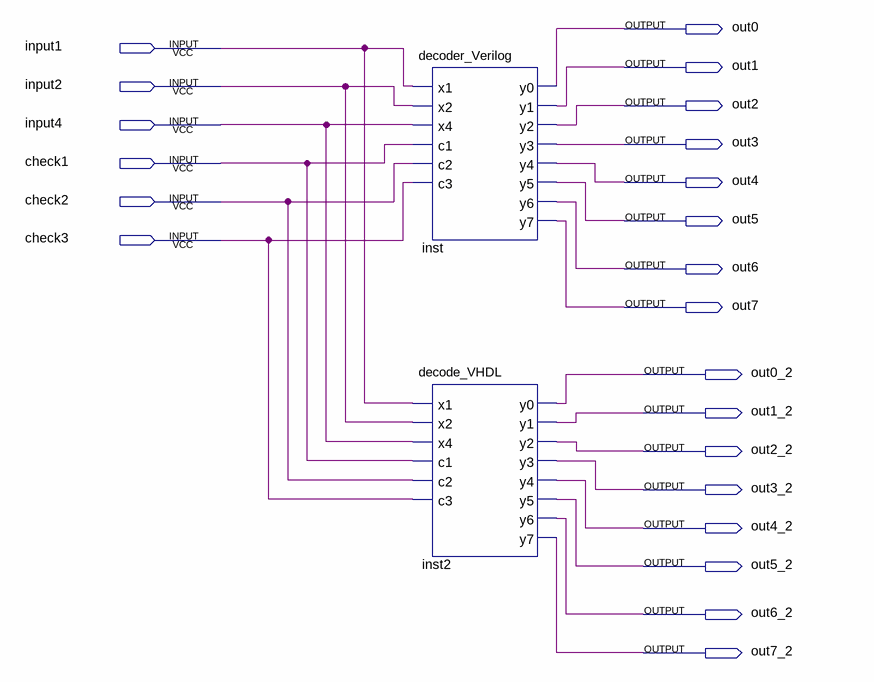
[diagram p0: schematic sheet]
// Quartus schematic Schem1_1.bdf as structural Verilog: 2 symbols, 22 pins
module Schem1_1 (
  input  input1,
  input  input2,
  input  input4,
  input  check1,
  input  check2,
  input  check3,
  output out0,
  output out1,
  output out2,
  output out3,
  output out4,
  output out5,
  output out6,
  output out7,
  output out0_2,
  output out1_2,
  output out2_2,
  output out3_2,
  output out4_2,
  output out5_2,
  output out6_2,
  output out7_2
);

  decoder_Verilog inst (
    .x1(input1), .x2(input2), .x4(input4), .c1(check1), .c2(check2), .c3(check3), .y0(out0), .y1(out1),
    .y2(out2), .y3(out3), .y4(out4), .y5(out5), .y6(out6), .y7(out7));
  decode_VHDL inst2 (
    .x1(input1), .x2(input2), .x4(input4), .c1(check1), .c2(check2), .c3(check3), .y0(out0_2), .y1(out1_2),
    .y2(out2_2), .y3(out3_2), .y4(out4_2), .y5(out5_2), .y6(out6_2), .y7(out7_2));
endmodule
